# EAGLE design TeleInfoNode (EAGLE 7.2.0)
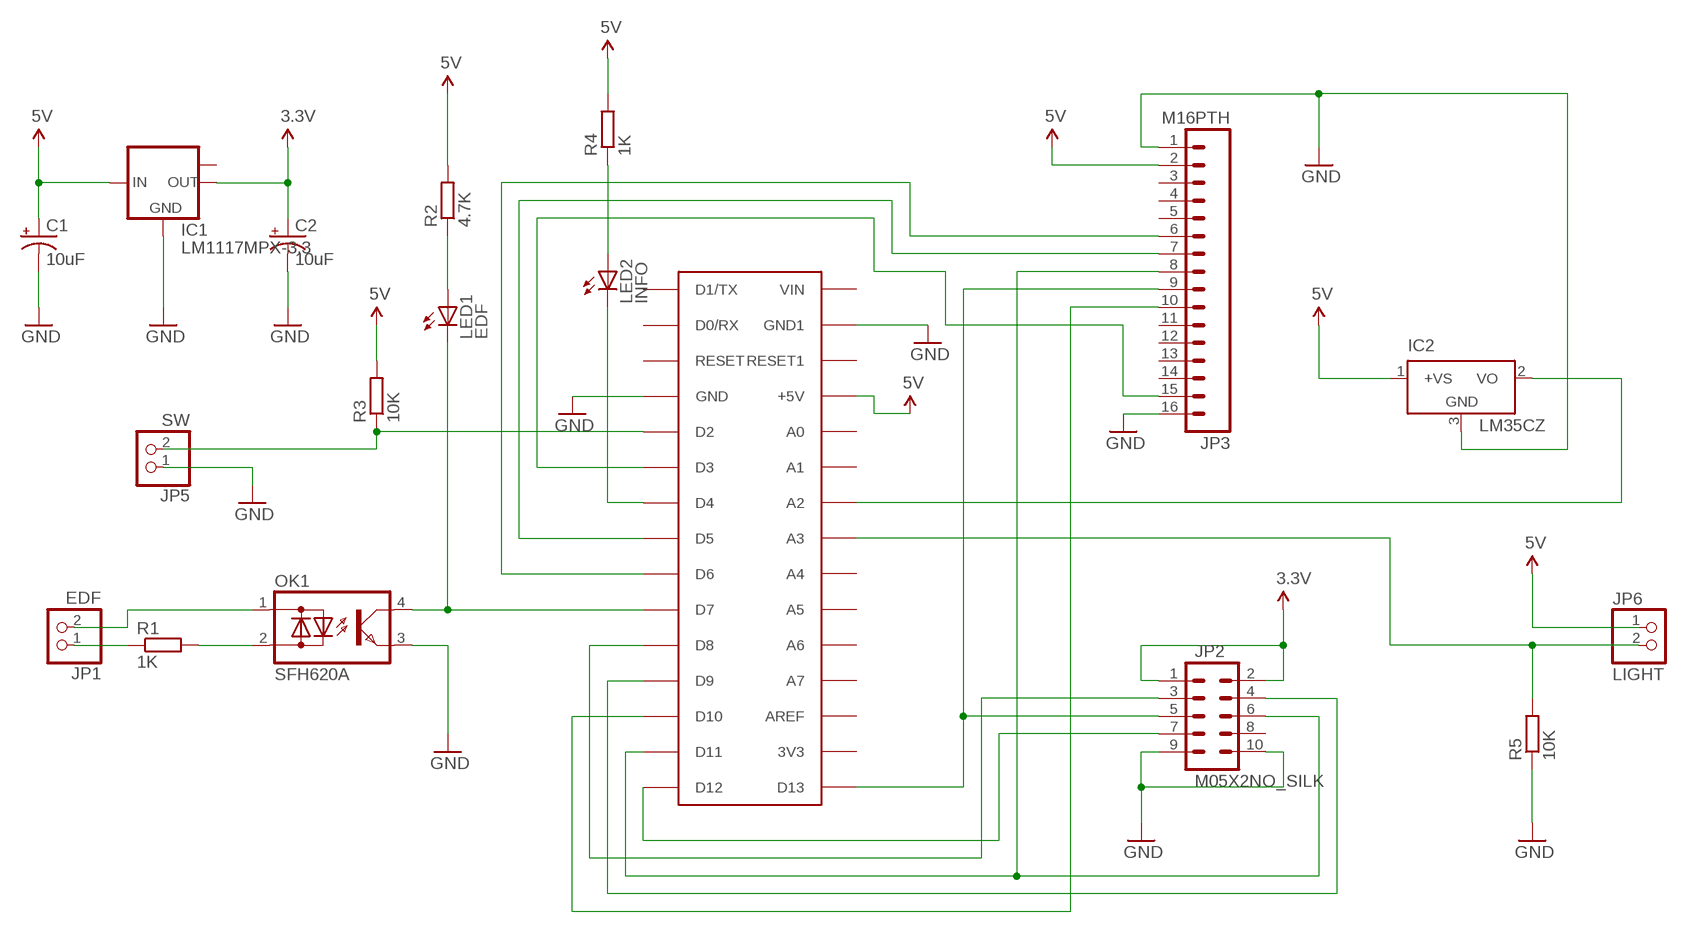
[diagram p0: schematic, sheet 1]

## Parts
C1  10uF  10UF-16V-10%(TANT)  [EIA3216]
C2  10uF  10UF-16V-10%(TANT)  [EIA3216]
IC1  LM1117MPX-3.3  [SOT223]
IC2  LM35CZ  [TO92]
JP1  EDF  PINHD-1X2  [1X02]
JP2  M05X2NO_SILK  [2X5_NOSILK]
JP3  M16PTH  [1X16]
JP5  SW  PINHD-1X2  [1X02]
JP6  LIGHT  PINHD-1X2  [1X02]
LED1  EDF  LED3MM  [LED3MM]
LED2  INFO  LED3MM  [LED3MM]
OK1  SFH620A  [DIL04]
R1  1K  R-EU_0204/7  [0204/7]
R2  4.7K  R-EU_0204/7  [0204/7]
R3  10K  R-EU_0204/7  [0204/7]
R4  1K  R-EU_0204/7  [0204/7]
R5  10K  R-EU_0204/7  [0204/7]
U$1  ARDUINONANO  [PDIP-32]

## Nets
3.3V: C2.A(+) IC1.2(OUT) JP2.1 JP2.2
5V: C1.A(+) IC1.3(IN) IC2.1(+VS) JP3.2 JP6.1 R2.2 R3.2 R4.2 U$1.+5V
GND: C1.C(-) C2.C(-) IC1.1(GND) IC2.3(GND) JP2.9 JP2.10 JP3.1 JP3.16 JP5.1 OK1.3(E) R5.1 U$1.GND U$1.GND1
N$1: LED1.K(C) OK1.4(C) U$1.D7
N$2: LED1.A R2.1
N$3: JP1.2 OK1.1(AC1)
N$4: JP1.1 R1.1
N$5: OK1.2(AC2) R1.2
N$6: JP2.3 U$1.D8
N$7: JP2.4 U$1.D9
N$8: JP2.5 JP3.9 U$1.D13
N$9: JP2.6 JP3.8 U$1.D11
N$10: JP2.7 U$1.D12
N$11: IC2.2(VO) U$1.A2
N$12: JP3.10 U$1.D10
N$13: JP3.6 U$1.D6
N$14: JP3.7 U$1.D5
N$15: JP3.15 U$1.D3
N$16: LED2.A R4.1
N$17: LED2.K(C) U$1.D4
N$18: JP5.2 R3.1 U$1.D2
N$19: JP6.2 R5.2 U$1.A3
Unconnected: IC1.TAB(OUT1) JP2.8 JP3.3 JP3.4 JP3.5 JP3.11 JP3.12 JP3.13 JP3.14 U$1.3V3 U$1.A0 U$1.A1 U$1.A4 U$1.A5 U$1.A6 U$1.A7 U$1.AREF U$1.D0/RX U$1.D1/TX U$1.RESET U$1.RESET1 U$1.VIN

## Library data of the parts
C1 C2 = SparkFun-Capacitors:10UF-16V-10%(TANT): CAP-00811 1206/EIA-3216 Tantalum capacitor; PROD_ID: CAP-00811
IC1 = lm1117:LM1117MPX-*
IC2 = lm35:LM35: Single-Supply Centigrade Temperature Sensor Vout = (10mV/°C x Temp °C) +5mmmV Source: http://www.national.com/ds/LM/LM35.pdf
JP1 JP5 JP6 = pinhead:PINHD-1X2: PIN HEADER
JP2 = SparkFun-Connectors:M05X2: Header 5x2 Standard 10-pin dual row 0.1" header. Commonly used with AVR-ISP. Use with Spark Fun Electronics SKU: PRT-00778
JP3 = SparkFun-Connectors:M16: 1x16 .1" header
LED1 LED2 = adafruit:LED: LED OSRAM: - CHIPLED LG R971, LG N971, LY N971, LG Q971, LY Q971, LO R971, LY R971 LH N974, LH R974 LS Q976, LO Q976, LY Q976 LO Q996 - Hyper CHIPLED LW Q18S LB Q993, LB Q99A, LB R99A - SideLED LS A670, LO A670, LY A670, LG A670, LP A670 LB A673, LV A673, LT A673, LW A673 LH A674 LY A675 LS A676, LA A676, LO A676, LY A676, LW A676 LS A679, LY A679, LG A679 - Hyper Micro SIDELED® LS Y876, LA Y876, LO Y876, LY Y876 LT Y87S - SmartLED LW L88C, LW L88S LB L89C, LB L89S, LG L890 LS L89K, LO L89K, LY L89K LS L896, LA L896, LO L896, LY L896 - TOPLED LS T670, LO T670, LY T670, LG T670, LP T670 LSG T670, LSP T670, LSY T670, LOP T670, LYG T670 LG T671, LOG T671, LSG T671 LB T673, LV T673, LT T673, LW T673 LH T674 LS T676, LA T676, LO T676, LY T676, LB T676, LH T676, LSB T676, LW T676 LB T67C, LV T67C, LT T67C, LS T67K, LO T67K, LY T67K, LW E67C LS E67B, LA E67B, LO E67B, LY E67B, LB E67C, LV E67C, LT E67C LW T67C LS T679, LY T679, LG T679 LS T770, LO T770, LY T770, LG T770, LP T770 LB T773, LV T773, LT T773, LW T773 LH T774 LS E675, LA E675, LY E675, LS T675 LS T776, LA T776, LO T776, LY T776, LB T776 LHGB T686 LT T68C, LB T68C - Hyper Mini TOPLED® LB M676 - Mini TOPLED Santana® LG M470 LS M47K, LO M47K, LY M47K Source: http://www.osram.convergy.de/
OK1 = optocoupler:SFH620: Optocoupler, Phototransistor Output, AC Input Source: http://www.vishay.com/docs/83675/sfh620.pdf; MPN: SFH620A-2; OC_FARNELL: 1469594; OC_NEWARK: 97K9546
R1-R5 = rcl:R-EU_: RESISTOR, European symbol
U$1 = jet-lib:ARDUINONANO

## Board
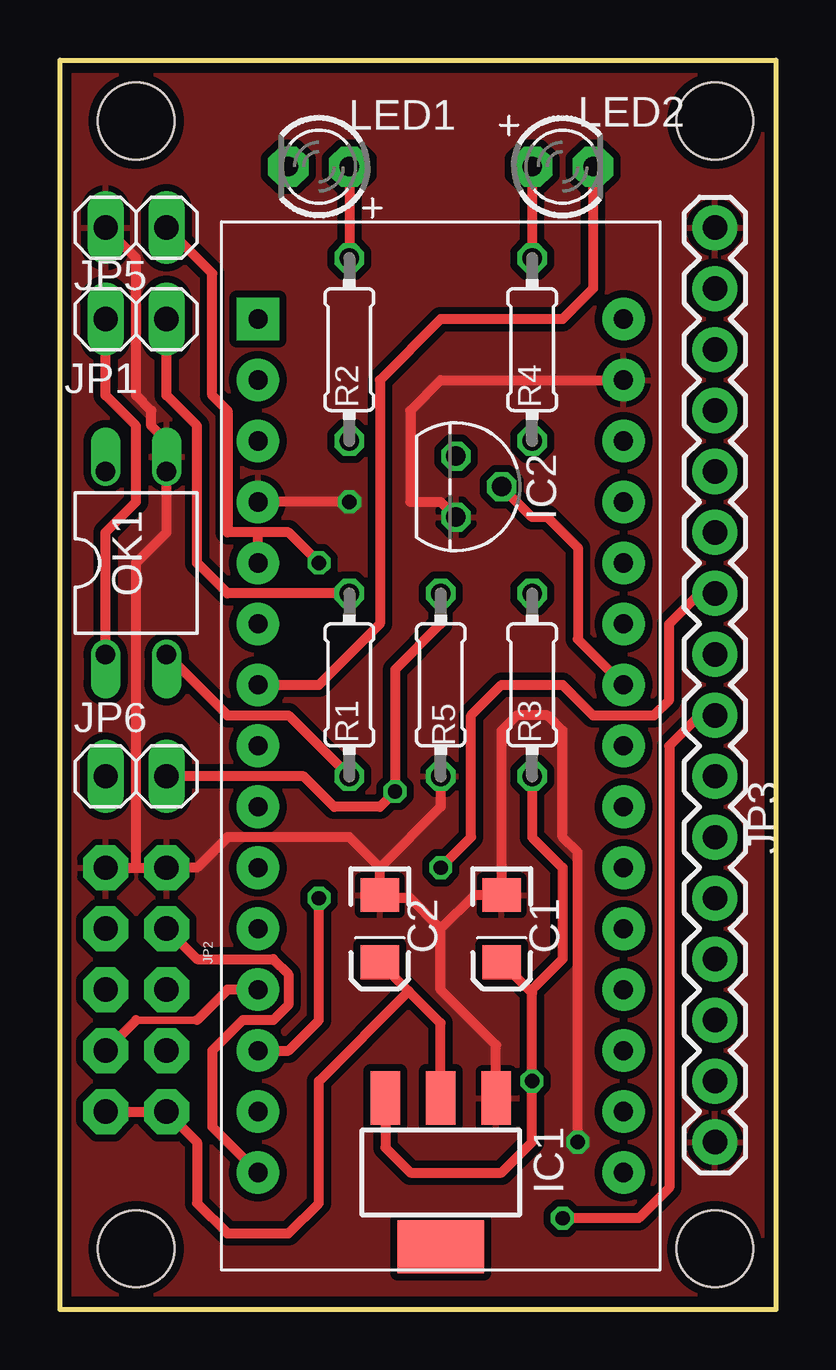
[diagram p1: board, top side]
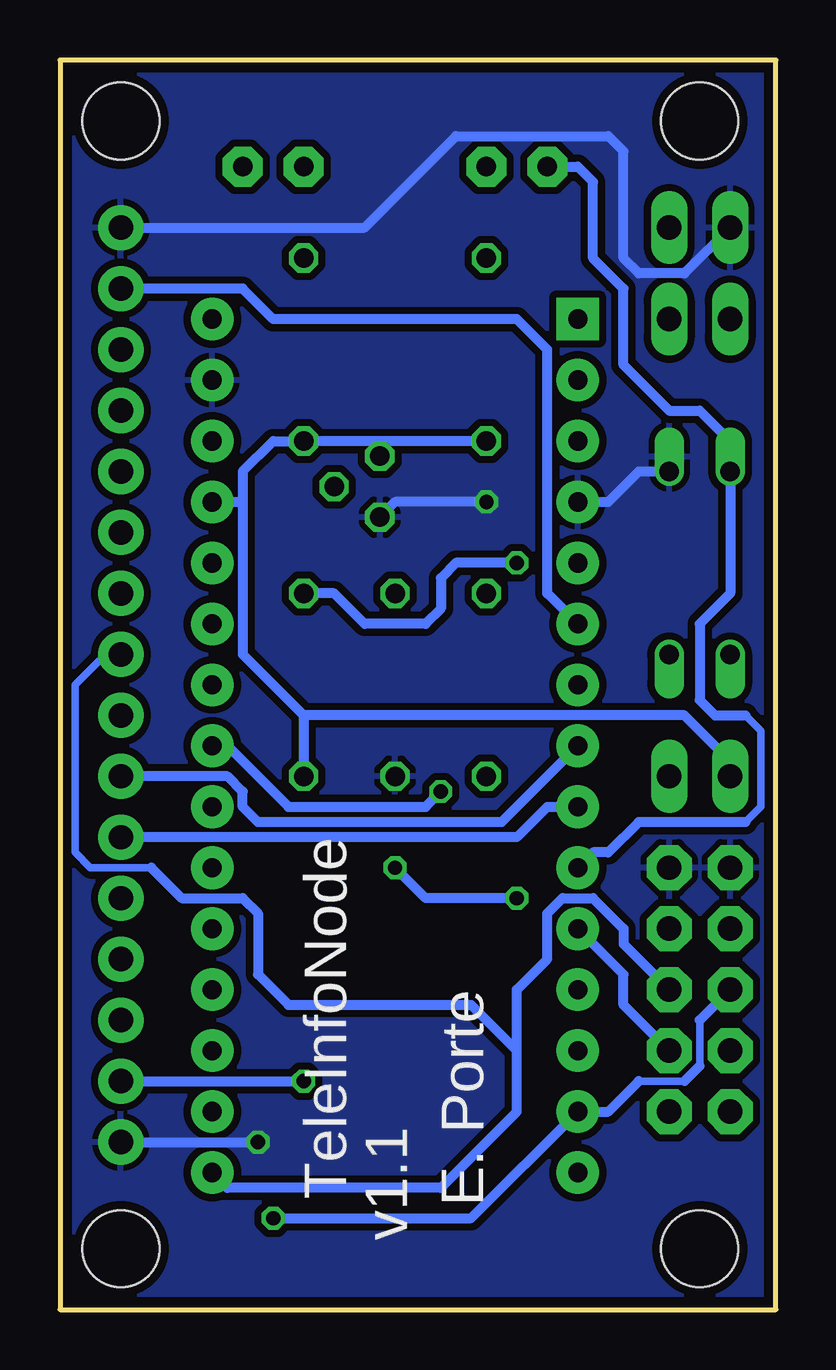
[diagram p2: board, bottom side, seen from below]

Size 29.84 x 52.07 mm. Coordinates in mm from the lower left corner, seen from the top.
Outline: 0,52.07 29.84,52.07 29.84,0 0,0 0,52.07
Copper layers (1*16): Top 0.0356mm / dielectric 1.5011mm / Bottom 0.0356mm
Design rules "LaenPCBOrder": minimum track width 6mil, minimum drill 13mil, track to track 6mil, track to pad 6mil, pad to pad 6mil, via to via 6mil, smd to smd 6mil, copper to edge 15mil, drill to drill 6mil, minimum pad ring 7mil, minimum via ring 7mil, stop-mask expansion 3mil, vias tented up to drill 0mil, thermal gap 10mil
Holes 3.2 mm at 27.3,2.54 3.18,2.54 3.18,49.53 27.3,49.53

### Footprints (pad centres in the part's own frame; a part is rotated, then mirrored left to right if it is on the bottom)
EIA3216 = smd 1.4 x 1.6: A 1.4,0; C -1.4,0
SOT223 = smd 1.219 x 2.235: 1 -2.311,-3.099; 2 0,-3.099; 3 2.311,-3.099 | smd 3.6 x 2.2: TAB 0,3.099
TO92 = drill 0.813 octagon: 1 -1.27,0; 2 0,1.905; 3 1.27,0
1X02 = drill 1.016 long: 1 -1.27,0; 2 1.27,0
2X5_NOSILK = drill 1.016 pad 1.88 octagon: 1 -1.27,5.08; 2 1.27,5.08; 3 -1.27,2.54; 4 1.27,2.54; 5 -1.27,0; 6 1.27,0; 7 -1.27,-2.54; 8 1.27,-2.54; 9 -1.27,-5.08; 10 1.27,-5.08
1X16 = drill 1.016 pad 1.88: 1 0,0; 2 2.54,0; 3 5.08,0; 4 7.62,0; 5 10.16,0; 6 12.7,0; 7 15.24,0; 8 17.78,0; 9 20.32,0; 10 22.86,0; 11 25.4,0; 12 27.94,0; 13 30.48,0; 14 33.02,0; 15 35.56,0; 16 38.1,0
LED3MM = drill 0.813 pad 1.676 octagon: A -1.27,0; K 1.27,0
DIL04 = drill 0.813 offset: 1 -1.27,-3.81; 2 1.27,-3.81; 3 1.27,3.81; 4 -1.27,3.81
0204/7 = drill 0.813 octagon: 1 -3.81,0; 2 3.81,0
PDIP-32 = drill 0.8 pad 1.778: 3V3 15.24,-35.56; +5V 15.24,-10.16; A0 15.24,-12.7; A1 15.24,-15.24; A2 15.24,-17.78; A3 15.24,-20.32; A4 15.24,-22.86; A5 15.24,-25.4; A6 15.24,-27.94; A7 15.24,-30.48; AREF 15.24,-33.02; D0/RX 0,-5.08; D2 0,-12.7; D3 0,-15.24; D4 0,-17.78; D5 0,-20.32; D6 0,-22.86; D7 0,-25.4; D8 0,-27.94; D9 0,-30.48; D10 0,-33.02; D11 0,-35.56; D12 0,-38.1; D13 15.24,-38.1; GND 0,-10.16; GND1 15.24,-5.08; RESET 0,-7.62; RESET1 15.24,-7.62; VIN 15.24,-2.54 | drill 0.8 pad 1.778 square: D1/TX 0,-2.54

### Placement (x,y rotation side)
C1  18.41,15.88 270 top
C2  13.34,15.88 270 top
IC1  15.87,5.71 180 top
IC2  16.51,34.29 270 top
JP1  3.18,41.27 180 top
JP2  3.18,13.34 180 top
JP3  27.3,6.98 90 top
JP5  3.18,45.09 0 top
JP6  3.18,22.23 0 top
LED1  10.79,47.62 180 top
LED2  20.95,47.62 0 top
OK1  3.18,31.12 0 top
R1  12.07,26.03 270 top
R2  12.07,40 270 top
R3  19.68,26.03 270 top
R4  19.68,40 270 top
R5  15.87,26.03 90 top
U$1  8.26,43.82 0 top

### Tracks (layer width: path | path; a pad name or v marks a point on that pad's centre or on a via)
3.3V
  Top 0.406: IC1.2 15.87,11.93 14.54,13.27 | 14.54,13.27 C2.A | JP2.2 JP2.1 5.71,6.98 5.71,4.45 6.98,3.17 9.52,3.17 10.79,4.45 10.79,9.52 14.54,13.27
5V  (via drill 0.6)
  Top 0.406: IC1.3 13.56,6.76 14.6,5.71 18.41,5.71 19.68,6.98 v19.68,9.52 19.68,13.2 19.62,13.27 | 19.62,13.27 C1.A | R3.2 19.68,19.68 20.95,18.41 20.95,14.6 19.62,13.27
  Bottom 0.406: R2.2 16.51,36.2 | 16.51,36.2 R4.2 20.95,36.2 22.23,34.92 22.23,33.66 | IC2.1 16.51,36.2 | 22.23,33.66 22.23,27.3 19.68,24.77 | 19.68,24.77 R3.2 | JP3.2 v19.68,9.52 | U$1.+5V 22.23,33.66 | JP6.1 1.9,22.86 3.81,24.77 19.68,24.77
GND  (via drill 0.6)
  Top 0.406: IC1.1 18.19,11.02 15.87,13.34 15.87,15.88 | 15.87,15.88 14.6,17.14 13.46,17.14 C2.C 13.34,18.41 | 15.87,15.88 17.27,17.27 C1.C 18.41,24.13 19.05,24.77 20.32,24.77 20.95,24.13 20.95,19.68 21.59,19.05 v21.59,6.98 | 13.34,18.41 12.07,19.68 6.98,19.68 5.71,18.41 JP2.9 3.18,18.41 | JP2.10 3.18,18.41 | 3.18,18.41 3.18,31.12 4.45,32.38 OK1.3 4.45,36.2 3.81,36.83 3.81,37.46 3.18,38.1 3.18,43.82 JP5.1 | U$1.GND1 15.87,38.73 14.6,37.46 14.6,33.66 15.87,33.66 IC2.3 | v12.07,33.66 U$1.GND | R5.1 15.87,20.95 13.34,18.41
  Bottom 0.406: JP3.16 17.15,45.09 13.34,48.9 6.98,48.9 6.35,48.26 6.35,43.82 5.71,43.18 3.81,43.18 JP5.1 | JP3.1 v21.59,6.98 | v12.07,33.66 15.87,33.66 IC2.3 | U$1.GND 6.98,33.66 5.71,34.92 OK1.3
  pour Bottom (isolate 0.305): -0.64,51.43 30.48,51.43 30.48,0.63 -0.64,0.63
  pour Top (isolate 0.305): -0.64,51.43 30.48,51.43 30.48,0.63 -0.64,0.63
N$1
  Bottom 0.305: 1.27,24.77 0.63,24.13 0.63,20.95 1.27,20.32
  Bottom 0.406: LED1.K 8.26,47.62 7.62,46.99 7.62,43.82 6.35,42.54 6.35,39.37 4.45,37.46 3.18,37.46 1.9,36.2 OK1.4 1.9,29.84 3.18,28.57 3.18,25.4 2.54,24.77 1.27,24.77 | 1.27,20.32 5.71,20.32 6.98,19.05 7.62,19.05 U$1.D7
N$2
  Top 0.406: LED1.A R2.1
N$3
  Top 0.406: OK1.1 1.9,32.38 3.18,33.66 3.18,36.83 1.9,38.1 JP1.2
N$4
  Top 0.406: R1.1 6.98,29.84 5.71,31.12 5.71,36.83 4.45,38.1 JP1.1
N$5
  Top 0.406: OK1.2 6.98,24.77 9.52,24.77 R1.2
N$6
  Bottom 0.406: JP2.3 6.35,12.7 6.35,13.97 U$1.D8
N$7
  Top 0.305: 5.71,12.06 3.18,12.06
  Top 0.406: 3.18,12.06 JP2.4 | U$1.D9 6.98,13.34 5.71,12.06
N$8
  Bottom 0.305: 27.94,27.3 29.21,26.03 29.21,19.05 28.57,18.41 26.04,18.41
  Bottom 0.406: 10.79,10.8 10.79,8.25 13.97,5.08 22.86,5.08 U$1.D13 | 10.79,10.8 10.79,13.34 9.52,14.6 9.52,16.51 8.89,17.14 7.62,17.14 6.35,15.88 6.35,15.24 JP2.5 | JP3.9 27.94,27.3 | 26.04,18.41 24.76,17.14 22.23,17.14 21.59,16.51 21.59,13.97 20.32,12.7 12.7,12.7 10.79,10.8
N$9  (via drill 0.6)
  Top 0.406: JP3.8 26.67,24.77 25.4,23.49 25.4,5.08 24.13,3.81 v20.95,3.81
  Bottom 0.305: 5.71,9.52 3.81,9.52 | 3.18,10.16 3.18,12.06
  Bottom 0.406: v20.95,3.81 12.7,3.81 U$1.D11 6.98,8.25 5.71,9.52 | 3.81,9.52 3.18,10.16 | 3.18,12.06 JP2.6
N$10
  Top 0.406: JP2.7 5.71,14.6 8.89,14.6 9.52,13.97 9.52,12.7 8.89,12.06 7.62,12.06 6.35,10.8 6.35,7.62 U$1.D12
N$11
  Top 0.406: U$1.A2 21.59,27.94 21.59,31.75 20.32,33.02 19.68,33.02 IC2.2
N$12  (via drill 0.6)
  Top 0.406: v10.79,17.14 10.79,12.06 9.52,10.8 U$1.D10 | JP3.10 26.67,29.84 25.4,28.57 25.4,25.4 24.76,24.77 22.23,24.77 20.95,26.03 18.41,26.03 17.15,24.77 17.15,19.68 v15.87,18.41
  Bottom 0.406: v10.79,17.14 14.6,17.14 v15.87,18.41
N$13
  Bottom 0.406: JP3.6 10.79,19.68 9.52,20.95 U$1.D6
N$14
  Bottom 0.406: U$1.D5 11.43,20.32 21.59,20.32 22.23,20.95 22.23,21.59 22.86,22.23 JP3.7
N$15
  Bottom 0.406: JP3.15 22.23,42.54 20.95,41.27 10.79,41.27 9.52,40 9.52,29.84 U$1.D3
N$16
  Top 0.406: LED2.A R4.1
N$17
  Top 0.406: LED2.K 22.23,42.54 20.95,41.27 15.87,41.27 13.34,38.73 13.34,28.57 10.79,26.03 U$1.D4
N$18  (via drill 0.6)
  Top 0.406: JP5.2 6.35,43.18 6.35,38.1 6.98,37.46 6.98,32.38 8.26,32.38 | v10.79,31.12 9.52,32.38 8.26,32.38 | U$1.D2 8.26,32.38
  Bottom 0.406: v10.79,31.12 13.34,31.12 13.97,30.48 13.97,29.21 14.6,28.57 17.15,28.57 18.41,29.84 R3.1
N$19  (via drill 0.6)
  Top 0.406: R5.2 15.87,28.57 13.97,26.67 v13.97,21.59 13.34,20.95 11.43,20.95 10.16,22.23 JP6.2
  Bottom 0.406: U$1.A3 22.86,23.49 20.32,20.95 14.6,20.95 v13.97,21.59

### Text on the board
bPlace: TeleInfoNode | E. Porte | v1.1